# EAGLE design deska (EAGLE 7.7.0)
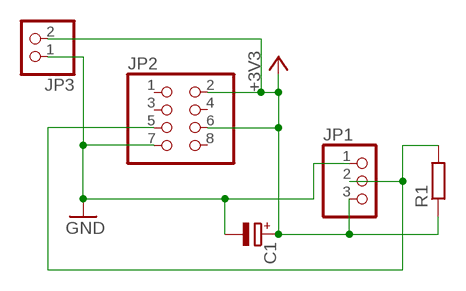
[diagram p0: schematic, sheet 1]

## Parts
C1  CPOL-EUE3.5-8  [E3,5-8]
JP1  PINHD-1X3  [1X03]
JP2  PINHD-2X4  [2X04]
JP3  PINHD-1X2  [1X02]
R1  R-EU_0204/7  [0204/7]

## Nets
+3V3: C1.+ JP1.3 JP2.2 JP2.6 JP3.2 R1.1
GND: C1.- JP1.1 JP2.7 JP3.1
N$1: JP1.2 JP2.5 R1.2
Unconnected: JP2.1 JP2.3 JP2.4 JP2.8

## Library data of the parts
C1 = rcl:CPOL-EU: POLARIZED CAPACITOR, European symbol
JP1 = pinhead:PINHD-1X3: PIN HEADER
JP2 = pinhead:PINHD-2X4: PIN HEADER
JP3 = pinhead:PINHD-1X2: PIN HEADER
R1 = rcl:R-EU_: RESISTOR, European symbol

## Board
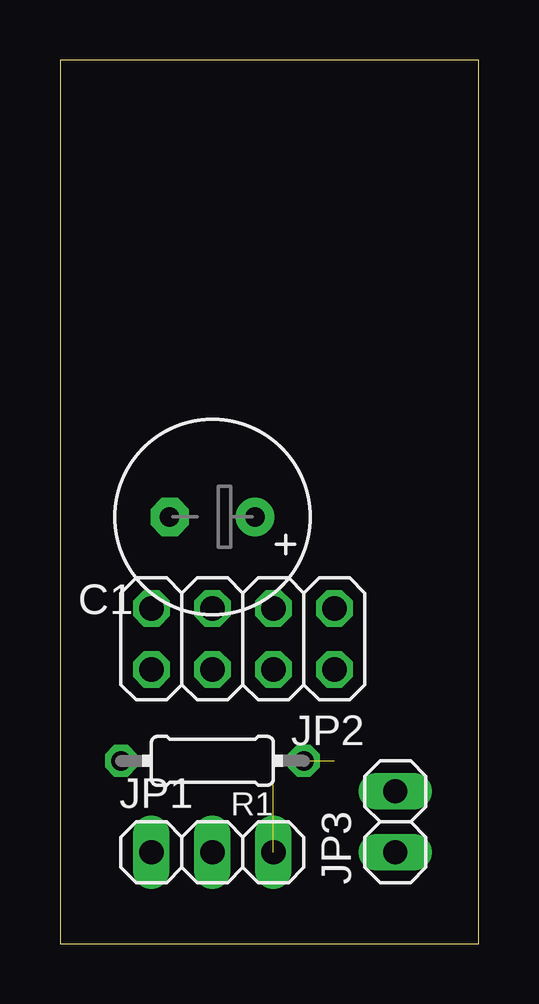
[diagram p1: board, top side]
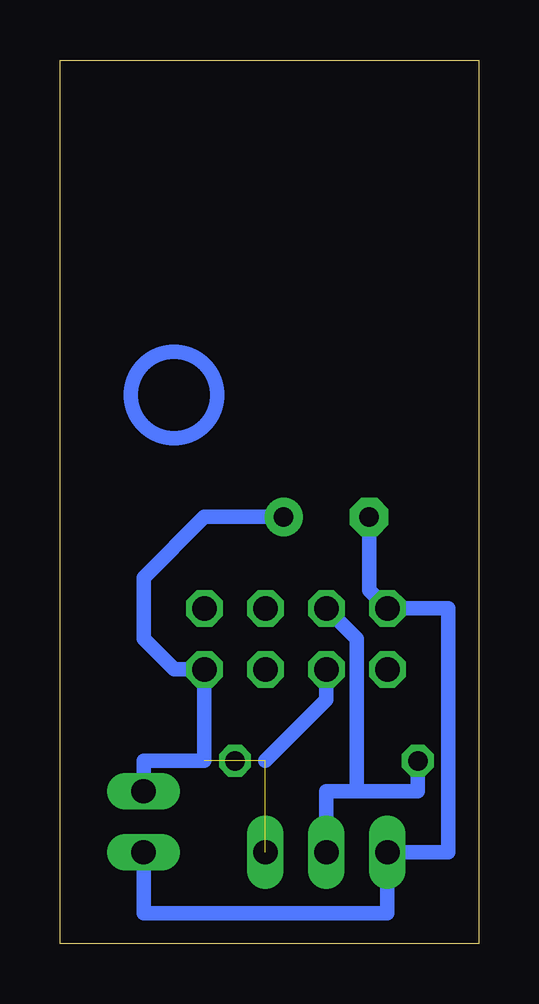
[diagram p2: board, bottom side, seen from below]

Size 17.45 x 36.82 mm. Coordinates in mm from the lower left corner, seen from the top.
Outline: 0,0 17.45,0 17.45,36.82 0,36.82 0,0
Copper layers (1*16): Top 0.035mm / dielectric 1.5mm / Bottom 0.035mm
Design rules "default": minimum track width 10mil, minimum drill 24mil, track to track 8mil, track to pad 8mil, pad to pad 8mil, via to via 8mil, smd to smd 8mil, copper to edge 40mil, drill to drill 8mil, minimum pad ring 10mil, minimum via ring 8mil, stop-mask expansion 4mil, vias tented up to drill 0mil, thermal gap 10mil

### Footprints (pad centres in the part's own frame; a part is rotated, then mirrored left to right if it is on the bottom)
E3,5-8 = drill 0.813 pad 1.6: + -1.778,0 | drill 0.813 pad 1.6 octagon: - 1.778,0
1X03 = drill 1.016 long: 1 -2.54,0; 2 0,0; 3 2.54,0
2X04 = drill 1.016 octagon: 1 -3.81,-1.27; 2 -3.81,1.27; 3 -1.27,-1.27; 4 -1.27,1.27; 5 1.27,-1.27; 6 1.27,1.27; 7 3.81,-1.27; 8 3.81,1.27
1X02 = drill 1.016 long: 1 -1.27,0; 2 1.27,0
0204/7 = drill 0.813 octagon: 1 -3.81,0; 2 3.81,0

### Placement (x,y rotation side)
C1  6.35,17.78 180 top
JP1  6.35,3.81 0 top
JP2  7.62,12.7 180 top
JP3  13.97,5.08 90 top
R1  6.35,7.62 180 top

### Tracks (layer width: path | path; a pad name or v marks a point on that pad's centre or on a via)
+3V3  (3 unrouted)
  Bottom 0.61: JP3.2 13.97,7.62 11.43,7.62 JP2.2 12.7,11.43 13.97,12.7 13.97,15.24 11.43,17.78 C1.+ | 8.89,7.62 6.35,10.16 JP2.6
GND
  Bottom 0.61: JP3.1 13.97,1.27 3.81,1.27 JP1.1 1.27,3.81 1.27,13.97 JP2.7 4.57,14.73 C1.-
N$1
  Bottom 0.61: JP1.2 6.35,6.35 5.08,6.35 | 5.08,6.35 2.54,6.35 R1.2 | JP2.5 5.08,12.7 5.08,6.35
(copper drawn outside any net)
  shapes: Bottom circle x1